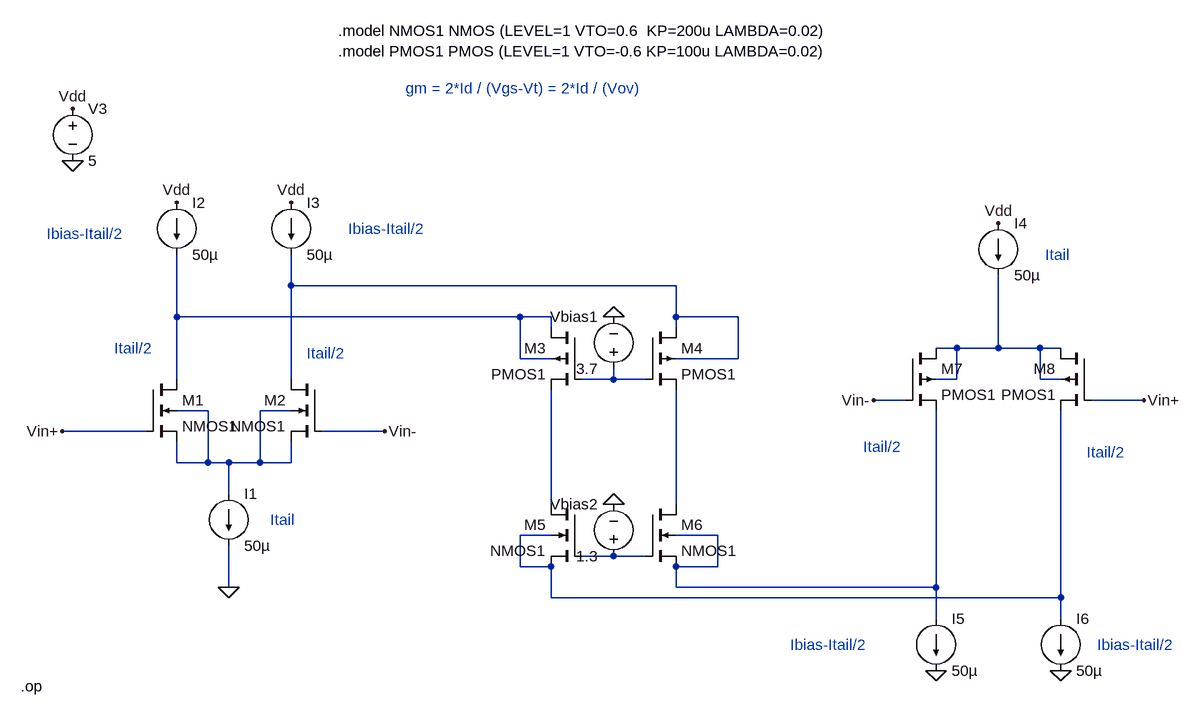
[diagram p0: schematic rail_to_rail_draft1.asc]
rail_to_rail_draft1.asc, the LTspice schematic file:
Version 4.1
SHEET 1 1612 680
WIRE 224 -32 224 -80
WIRE 816 -32 224 -32
WIRE 48 16 48 -80
WIRE 576 16 48 16
WIRE 624 16 576 16
WIRE 816 16 816 -32
WIRE 912 16 816 16
WIRE 624 32 624 16
WIRE 816 32 816 16
WIRE 1248 64 1216 64
WIRE 1312 64 1312 -48
WIRE 1312 64 1248 64
WIRE 1376 64 1312 64
WIRE 1408 64 1376 64
WIRE 576 80 576 16
WIRE 624 80 576 80
WIRE 912 80 912 16
WIRE 912 80 816 80
WIRE 48 112 48 16
WIRE 224 112 224 -32
WIRE 720 112 720 96
WIRE 720 112 672 112
WIRE 768 112 720 112
WIRE 1248 112 1248 64
WIRE 1248 112 1216 112
WIRE 1376 112 1376 64
WIRE 1408 112 1376 112
WIRE 1168 144 1120 144
WIRE 1536 144 1456 144
WIRE 96 160 48 160
WIRE 224 160 176 160
WIRE 0 192 -128 192
WIRE 368 192 272 192
WIRE 48 240 48 208
WIRE 96 240 96 160
WIRE 96 240 48 240
WIRE 128 240 96 240
WIRE 176 240 176 160
WIRE 176 240 128 240
WIRE 224 240 224 208
WIRE 224 240 176 240
WIRE 128 288 128 240
WIRE 624 304 624 128
WIRE 816 304 816 128
WIRE 624 352 576 352
WIRE 880 352 816 352
WIRE 720 384 672 384
WIRE 768 384 720 384
WIRE 576 400 576 352
WIRE 624 400 576 400
WIRE 880 400 880 352
WIRE 880 400 816 400
WIRE 128 432 128 368
WIRE 816 432 816 400
WIRE 1216 432 1216 160
WIRE 1216 432 816 432
WIRE 624 448 624 400
WIRE 1408 448 1408 160
WIRE 1408 448 624 448
WIRE 1216 480 1216 432
WIRE 1408 480 1408 448
FLAG 128 432 0
FLAG 1216 560 0
FLAG 1408 560 0
FLAG 1536 144 Vin+
FLAG -128 192 Vin+
FLAG 368 192 Vin-
FLAG 1120 144 Vin-
FLAG 720 16 0
FLAG 720 304 0
FLAG -112 -224 0
FLAG -112 -304 Vdd
FLAG 48 -160 Vdd
FLAG 224 -160 Vdd
FLAG 1312 -128 Vdd
SYMBOL nmos4 0 112 R0
SYMATTR InstName M1
SYMATTR Value NMOS1
SYMATTR Value2 l=300n w=300n
SYMBOL nmos4 272 112 M0
SYMATTR InstName M2
SYMATTR Value NMOS1
SYMATTR Value2 l=300n w=300n
SYMBOL current 128 288 R0
WINDOW 123 0 0 Left 0
WINDOW 39 0 0 Left 0
SYMATTR InstName I1
SYMATTR Value 50µ
SYMBOL current 48 -160 R0
WINDOW 123 0 0 Left 0
WINDOW 39 0 0 Left 0
SYMATTR InstName I2
SYMATTR Value 50µ
SYMBOL current 224 -160 R0
WINDOW 123 0 0 Left 0
WINDOW 39 0 0 Left 0
SYMATTR InstName I3
SYMATTR Value 50µ
SYMBOL pmos4 672 32 M0
SYMATTR InstName M3
SYMATTR Value PMOS1
SYMATTR Value2 l=300n w=300n
SYMBOL pmos4 768 32 R0
SYMATTR InstName M4
SYMATTR Value PMOS1
SYMATTR Value2 l=300n w=300n
SYMBOL nmos4 672 304 M0
SYMATTR InstName M5
SYMATTR Value NMOS1
SYMATTR Value2 l=300n w=300n
SYMBOL nmos4 768 304 R0
SYMATTR InstName M6
SYMATTR Value NMOS1
SYMATTR Value2 l=300n w=300n
SYMBOL pmos4 1168 64 R0
SYMATTR InstName M7
SYMATTR Value PMOS1
SYMATTR Value2 l=300n w=300n
SYMBOL pmos4 1456 64 M0
SYMATTR InstName M8
SYMATTR Value PMOS1
SYMATTR Value2 l=300n w=300n
SYMBOL current 1312 -128 R0
WINDOW 123 0 0 Left 0
WINDOW 39 0 0 Left 0
SYMATTR InstName I4
SYMATTR Value 50µ
SYMBOL current 1216 480 R0
WINDOW 123 0 0 Left 0
WINDOW 39 0 0 Left 0
SYMATTR InstName I5
SYMATTR Value 50µ
SYMBOL current 1408 480 R0
WINDOW 123 0 0 Left 0
WINDOW 39 0 0 Left 0
SYMATTR InstName I6
SYMATTR Value 50µ
SYMBOL voltage 720 112 R180
WINDOW 0 24 96 Left 2
WINDOW 3 24 16 Left 2
WINDOW 123 0 0 Left 0
WINDOW 39 0 0 Left 0
SYMATTR InstName Vbias1
SYMATTR Value 3.7
SYMBOL voltage 720 400 R180
WINDOW 0 24 96 Left 2
WINDOW 3 24 16 Left 2
WINDOW 123 0 0 Left 0
WINDOW 39 0 0 Left 0
SYMATTR InstName Vbias2
SYMATTR Value 1.3
SYMBOL voltage -112 -320 R0
WINDOW 123 0 0 Left 0
WINDOW 39 0 0 Left 0
SYMATTR InstName V3
SYMATTR Value 5
TEXT 192 328 Left 2 ;Itail
TEXT -48 64 Left 2 ;Itail/2
TEXT 248 72 Left 2 ;Itail/2
TEXT 1104 216 Left 2 ;Itail/2
TEXT 1448 224 Left 2 ;Itail/2
TEXT 1384 -80 Left 2 ;Itail
TEXT -152 -112 Left 2 ;Ibias-Itail/2
TEXT 312 -120 Left 2 ;Ibias-Itail/2
TEXT 992 520 Left 2 ;Ibias-Itail/2
TEXT 1464 520 Left 2 ;Ibias-Itail/2
TEXT 400 -336 Left 2 ;gm = 2*Id / (Vgs-Vt) = 2*Id / (Vov)
TEXT -192 584 Left 2 !.op
TEXT 296 -424 Left 2 !.model NMOS1 NMOS (LEVEL=1 VTO=0.6  KP=200u LAMBDA=0.02)\n.model PMOS1 PMOS (LEVEL=1 VTO=-0.6 KP=100u LAMBDA=0.02)

The netlist it stands for:
* rail_to_rail_draft1.asc
M1 N002 Vin+ N005 N005 NMOS1 l=300n w=300n
M2 N001 Vin- N005 N005 NMOS1 l=300n w=300n
I1 N005 0 50µ
I2 Vdd N002 50µ
I3 Vdd N001 50µ
M3 N002 N004 N006 N002 PMOS1 l=300n w=300n
M4 N001 N004 N007 N001 PMOS1 l=300n w=300n
M5 N006 N010 N008 N008 NMOS1 l=300n w=300n
M6 N007 N010 N009 N009 NMOS1 l=300n w=300n
M7 N003 Vin- N009 N003 PMOS1 l=300n w=300n
M8 N003 Vin+ N008 N003 PMOS1 l=300n w=300n
I4 Vdd N003 50µ
I5 N009 0 50µ
I6 N008 0 50µ
Vbias1 N004 0 3.7
Vbias2 N010 0 1.3
V3 Vdd 0 5
.model NMOS NMOS
.model PMOS PMOS
.lib standard.mos
* Itail
* Itail/2
* Itail/2
* Itail/2
* Itail/2
* Itail
* Ibias-Itail/2
* Ibias-Itail/2
* Ibias-Itail/2
* Ibias-Itail/2
* gm = 2*Id / (Vgs-Vt) = 2*Id / (Vov)
.op
.model NMOS1 NMOS (LEVEL=1 VTO=0.6  KP=200u LAMBDA=0.02)
.model PMOS1 PMOS (LEVEL=1 VTO=-0.6 KP=100u LAMBDA=0.02)
.backanno
.end